# EAGLE design pitching_v2 (EAGLE 9.5.1)
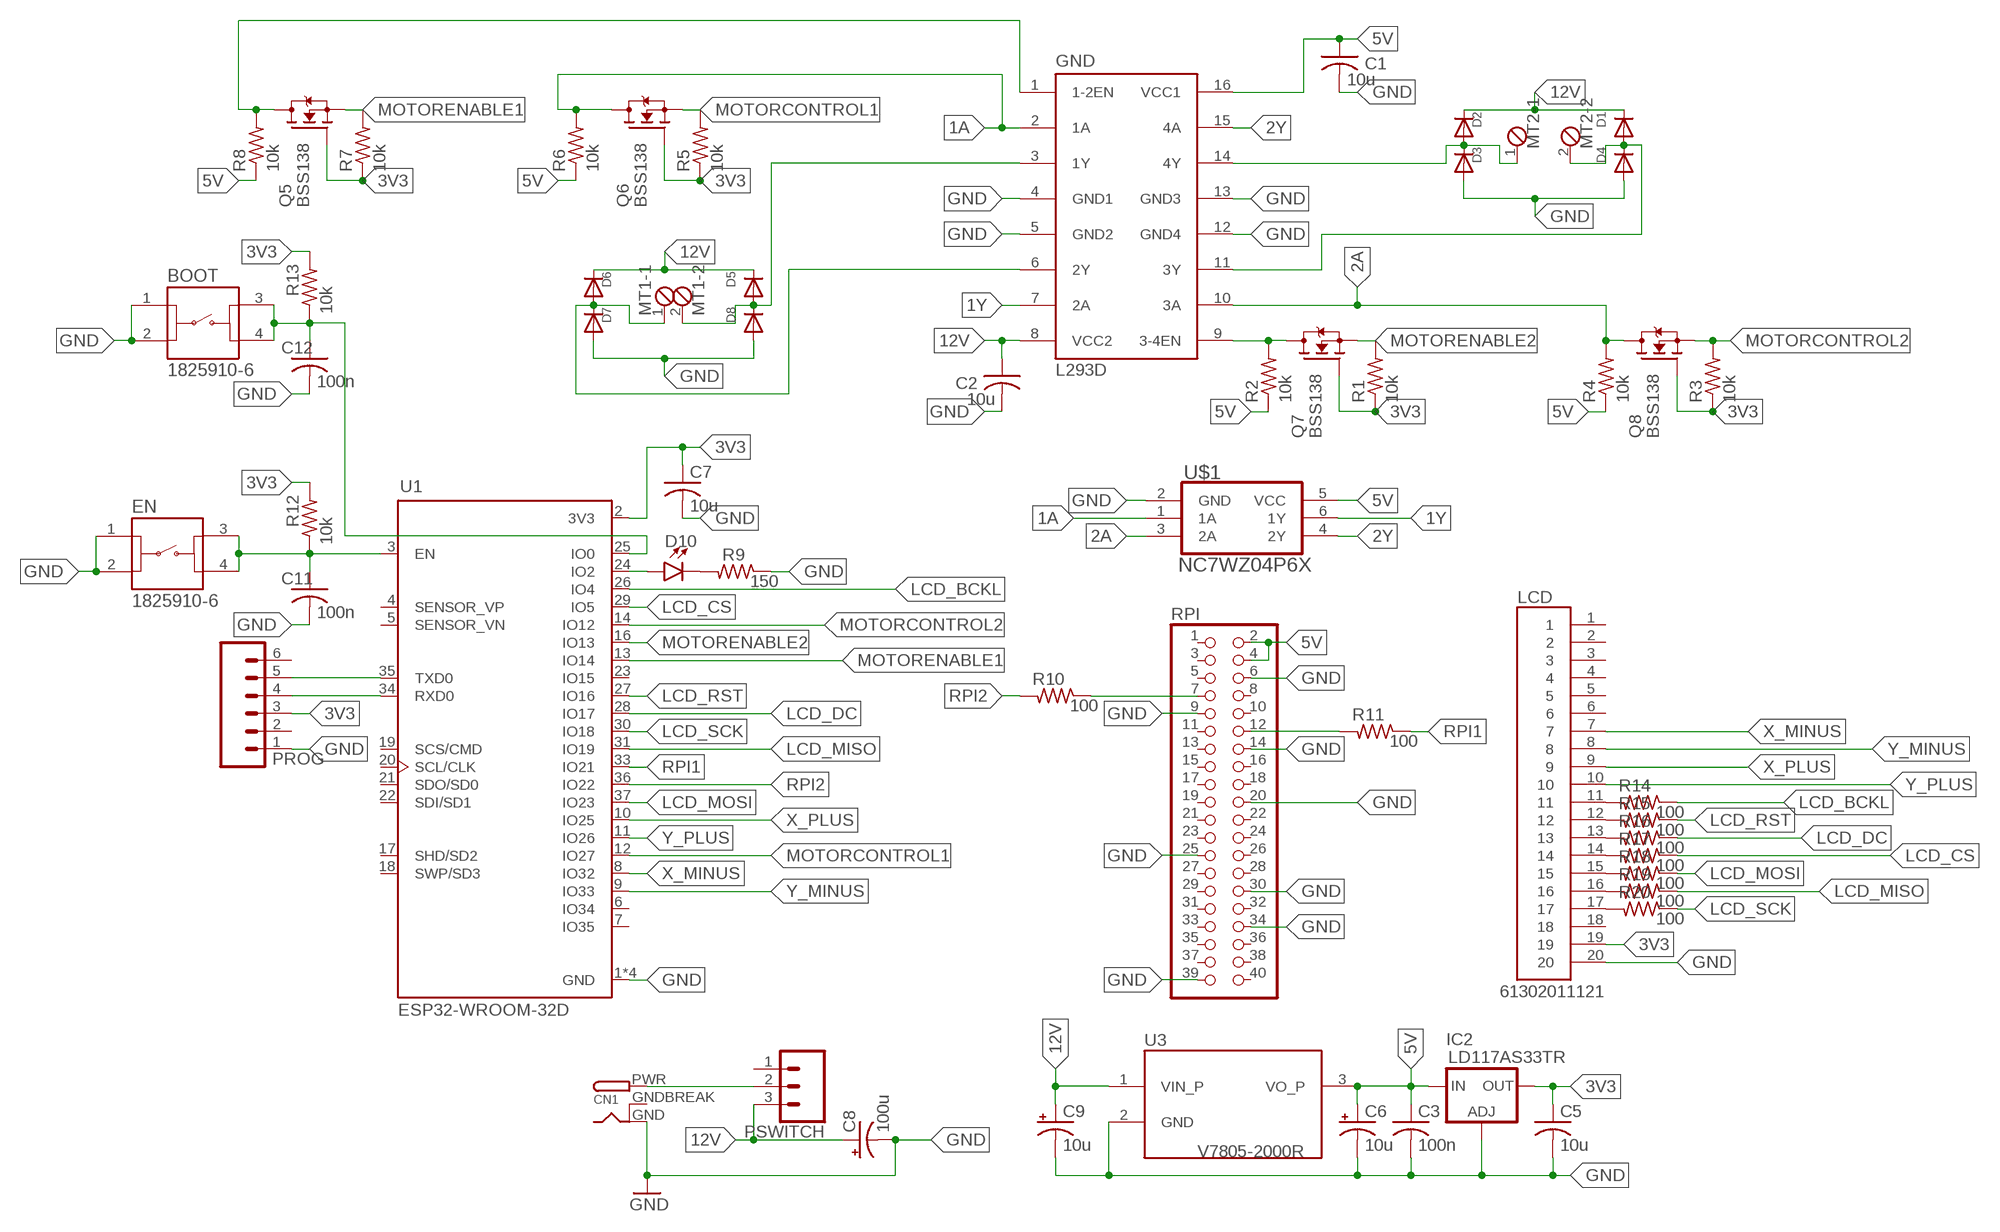
[diagram p0: schematic, sheet 1]

## Parts
BOOT  1825910-6  [1825910-6]
C1  10u  C-USC0805  [C0805]
C2  10u  C-USC0805  [C0805]
C3  100n  C-USC0805  [C0805]
C5  10u  C-USC0805  [C0805]
C6  10u  CPOL-US153CLV-0405  [153CLV-0405]
C7  10u  C-USC0805  [C0805]
C8  100u  CPOL-US153CLV-0810  [153CLV-0810]
C9  10u  CPOL-US153CLV-0405  [153CLV-0405]
C11  100n  C-USC0805  [C0805]
C12  100n  C-USC0805  [C0805]
CN1  DCBARRELPTH  [DCJACK_2MM_PTH]
D1  DIODESMA  [SMADIODE]
D2  DIODESMA  [SMADIODE]
D3  DIODESMA  [SMADIODE]
D4  DIODESMA  [SMADIODE]
D5  DIODESMA  [SMADIODE]
D6  DIODESMA  [SMADIODE]
D7  DIODESMA  [SMADIODE]
D8  DIODESMA  [SMADIODE]
D10  LED3MM  [LED_3MM]
EN  1825910-6  [1825910-6]
GND  L293D  [DIL16]
IC2  LD117AS33TR  [SOT223]
LCD  61302011121  [61302011121]
MT1  MPT2  [2POL254]
MT2  MPT2  [2POL254]
PROG  CONN_06SILK_FEMALE_PTH  [1X06]
PSWITCH  CONN_03  [1X03]
Q5  BSS138  [SOT23]
Q6  BSS138  [SOT23]
Q7  BSS138  [SOT23]
Q8  BSS138  [SOT23]
R1  10k  R-US_R0805  [R0805]
R2  10k  R-US_R0805  [R0805]
R3  10k  R-US_R0805  [R0805]
R4  10k  R-US_R0805  [R0805]
R5  10k  R-US_R0805  [R0805]
R6  10k  R-US_R0805  [R0805]
R7  10k  R-US_R0805  [R0805]
R8  10k  R-US_R0805  [R0805]
R9  150  R-US_R0805  [R0805]
R10  100  R-US_R0805  [R0805]
R11  100  R-US_R0805  [R0805]
R12  10k  R-US_R0805  [R0805]
R13  10k  R-US_R0805  [R0805]
R14  100  R-US_R0805  [R0805]
R15  100  R-US_R0805  [R0805]
R16  100  R-US_R0805  [R0805]
R17  100  R-US_R0805  [R0805]
R18  100  R-US_R0805  [R0805]
R19  100  R-US_R0805  [R0805]
R20  100  R-US_R0805  [R0805]
RPI  PINHD-2X20  [2X20]
U1  ESP32-WROOM-32D  [MODULE_ESP32-WROOM-32D]
U3  V7805-2000R  [CONV_V7805-2000R]
U$1  NC7WZ04P6X  [SOT65P210X110-6N]

## Nets
1A: GND.2(1A) Q6.3(D) R6.2 U$1.1(1A)
1Y: GND.7(2A) U$1.6(1Y)
2A: GND.10(3A) Q8.3(D) R4.2 U$1.3(2A)
2Y: GND.15(4A) U$1.4(2Y)
3V3: C5.1 C7.1 IC2.4(OUT) LCD.19 PROG.3 Q5.1(G) Q6.1(G) Q7.1(G) Q8.1(G) R1.1 R3.1 R5.1 R7.1 R12.2 R13.2 U1.2(3V3)
5V: C1.1 C3.1 C6.+ GND.16(VCC1) IC2.3(IN) R2.1 R4.1 R6.1 R8.1 RPI.2 RPI.4 U3.3(VO_P) U$1.5(VCC)
12V: C2.1 C8.+ C9.+ D1.C D2.C D5.C D6.C GND.8(VCC2) PSWITCH.3 U3.1(VIN_P)
BOOT: BOOT.3 BOOT.4 C12.1 R13.1 U1.25(IO0)
EN: C11.1 EN.3 EN.4 R12.1 U1.3(EN)
GND: BOOT.1 BOOT.2 C1.2 C2.2 C3.2 C5.2 C6.- C7.2 C8.- C9.- C11.2 C12.2 CN1.GND D3.A D4.A D7.A D8.A EN.1 EN.2 GND.4(GND1) GND.5(GND2) GND.12(GND4) GND.13(GND3) IC2.1(ADJ) LCD.20 PROG.1 R9.1 RPI.6 RPI.9 RPI.14 RPI.20 RPI.25 RPI.30 RPI.34 RPI.39 U1.1(GND) U1.15(GND) U1.38(GND) U1.39(GND) U3.2(GND) U$1.2(GND)
LCD_BCKL: R14.1 U1.26(IO4)
LCD_CS: R17.1 U1.29(IO5)
LCD_DC: R16.1 U1.28(IO17)
LCD_MISO: R19.1 U1.31(IO19)
LCD_MOSI: R18.1 U1.37(IO23)
LCD_RST: R15.1 U1.27(IO16)
LCD_SCK: R20.1 U1.30(IO18)
M1+: D5.A D8.C GND.3(1Y) MT1.2
M1-: D6.A D7.C GND.6(2Y) MT1.1
M2+: D1.A D4.C GND.11(3Y) MT2.2
M2-: D2.A D3.C GND.14(4Y) MT2.1
MOTORCONTROL1: Q6.2(S) R5.2 U1.12(IO27)
MOTORCONTROL2: Q8.2(S) R3.2 U1.14(IO12)
MOTORENABLE1: Q5.2(S) R7.2 U1.13(IO14)
MOTORENABLE2: Q7.2(S) R1.2 U1.16(IO13)
N$1: CN1.PWR PSWITCH.2
N$2: R11.2 RPI.12
N$3: LCD.11 R14.2
N$4: R10.1 RPI.7
N$7: LCD.12 R15.2
N$9: LCD.13 R16.2
N$10: GND.1(1-2EN) Q5.3(D) R8.2
N$11: GND.9(3-4EN) Q7.3(D) R2.2
N$13: D10.K(C) R9.2
N$14: LCD.14 R17.2
N$15: LCD.15 R18.2
N$16: PROG.5 U1.35(TXD0)
N$17: LCD.16 R19.2
N$18: LCD.17 R20.2
N$21: PROG.4 U1.34(RXD0)
N$26: D10.A U1.24(IO2)
RPI1: R11.1 U1.33(IO21)
RPI2: R10.2 U1.36(IO22)
X_MINUS: LCD.7 U1.8(IO32)
X_PLUS: LCD.9 U1.10(IO25)
Y_MINUS: LCD.8 U1.9(IO33)
Y_PLUS: LCD.10 U1.11(IO26)
Unconnected: LCD.1 LCD.2 LCD.3 LCD.4 LCD.5 LCD.6 LCD.18 PROG.2 PROG.6 PSWITCH.1 RPI.1 RPI.3 RPI.5 RPI.8 RPI.10 RPI.11 RPI.13 RPI.15 RPI.16 RPI.17 RPI.18 RPI.19 RPI.21 RPI.22 RPI.23 RPI.24 RPI.26 RPI.27 RPI.28 RPI.29 RPI.31 RPI.32 RPI.33 RPI.35 RPI.36 RPI.37 RPI.38 RPI.40 U1.4(SENSOR_VP) U1.5(SENSOR_VN) U1.6(IO34) U1.7(IO35) U1.17(SHD/SD2) U1.18(SWP/SD3) U1.19(SCS/CMD) U1.20(SCL/CLK) U1.21(SDO/SD0) U1.22(SDI/SD1) U1.23(IO15)

## Power pins joined to a net without a drawn wire
GNDBREAK: CN1.GNDBREAK

## Library data of the parts
BOOT EN = Switch:1825910-6: SWITCH TACTILE SPST-NO 0.05A 24V Manufacturer's datasheet <https://www.te.com/commerce/DocumentDelivery/DDEController?Action=srchrtrv&DocNm=1825910&DocType=Customer+Drawing&DocLang=English>; CREATED_BY: PCBLayout.com; DIGIKEY_PART_NUMBER: 450-1650-ND; MANUFACTURER: TE Connectivity ALCOSWITCH Switches; MPN: 1825910-6
C1-C3 C5 C7 C11 C12 = resistor:C-US: CAPACITOR, American symbol
C6 C8 C9 = rcl:CPOL-US: POLARIZED CAPACITOR, American symbol; SPICEPREFIX: C
CN1 = adafruit:DCBARREL: 2.0mm DC Barrel Jack DCJACK_2MM_PTH - Through Hole Jack (4UConnector: 05537)
D1-D8 = adafruit:DIODE: Diode SMADIODE - SMA Surface Mount Package 20V 1A Schottky Diode Digikey: 641-1014-6-ND DO-1N4148 - Through Hole Small Current Diode SOD-123 20V 1 A (.5mV Vf) Schottky Diode - Digikey: MBRX120TPMSCT-ND SOD-323 10V 570mA (.38mV Vf, 3ns) Schottky Diode - Digikey: ZLLS410CT-ND SOD-523 30V 30mA Schottky Diode (RB751S-40TE61) - Digikey: RB751S-40TE61CT-ND SOT23-R/W - SOT23 Package (R = Solder Paste/Reflow Ovens, W = Hand-Soldering) BAT54Film 40V 300mA - Digikey: 497-7162-1-ND
D10 = SparkFun-LED:LED: LED (Generic) Standard schematic elements and footprints for 5mm, 3mm, 1206, and 0603 sized LEDs. Generic LEDs with no color specified.; PROD_ID: DIO-08794
GND = st-microelectronics:L293D: PUSH-PULL 4 CHANNEL DRIVER; MPN: L293D; OC_FARNELL: 9589619; OC_NEWARK: 56P8249
IC2 = v-reg:LD117A?*: Low drop fixed and adjustable positive voltage regulators 1 A Source: http://www.st.com/stonline/products/literature/ds/7194/ld1117axx.pdf
LCD = Headers:61302011121: CONN HEADER VERT 20POS 2.54MM Manufacturer's datasheet <https://katalog.we-online.de/em/datasheet/6130xx11121.pdf>; CREATED_BY: PCBLayout.com; DIGIKEY_PART_NUMBER: 732-5329-ND; MANUFACTURER: Wurth Electronics Inc.; MPN: 61302011121
MT1 MT2 = con-phoenix-254:MPT2: PHOENIX CONNECTOR; OC_FARNELL: unknown; OC_NEWARK: unknown
PROG = SparkFun-Connectors:CONN_06: Multi connection point. Often used as Generic Header-pin footprint for 0.1 inch spaced/style header connections On any of the 0.1 inch spaced packages, you can populate with these: Break Away Headers - Straight <https://www.sparkfun.com/products/116> (PRT-00116) Break Away Male Headers - Right Angle <https://www.sparkfun.com/products/553> (PRT-00553) Female Headers <https://www.sparkfun.com/products/115> (PRT-00115) Break Away Headers - Machine Pin <https://www.sparkfun.com/products/117> (PRT-00117) Break Away Female Headers - Swiss Machine Pin <https://www.sparkfun.com/products/743> (PRT-00743) Arduino Stackable Header - 6 Pin <https://www.sparkfun.com/products/9280> (PRT-09280) For SCREWTERMINALS and SPRING TERMINALS visit here: Screw Terimnals on SparkFun.com <https://www.sparkfun.com/search/results?term=Screw+Terminals> (5mm/3.5mm/2.54mm spacing) This device is also useful as a general connection point to wire up your design to another part of your project. Our various solder wires solder well into these plated through hole pads. Hook-Up Wire - Assortment (Stranded, 22 AWG) <https://www.sparkfun.com/products/11375> (PRT-11375) Hook-Up Wire - Assortment (Solid Core, 22 AWG) <https://www.sparkfun.com/products/11367> (PRT-11367) View the entire wire category on our website here <https://www.sparkfun.com/categories/141>; PROD_ID: CONN-08437
PSWITCH = SparkFun-Connectors:CONN_03: Multi connection point. Often used as Generic Header-pin footprint for 0.1 inch spaced/style header connections On any of the 0.1 inch spaced packages, you can populate with these: Break Away Headers - Straight <https://www.sparkfun.com/products/116> (PRT-00116) Break Away Male Headers - Right Angle <https://www.sparkfun.com/products/553> (PRT-00553) Female Headers <https://www.sparkfun.com/products/115> (PRT-00115) Break Away Headers - Machine Pin <https://www.sparkfun.com/products/117> (PRT-00117) Break Away Female Headers - Swiss Machine Pin <https://www.sparkfun.com/products/743> (PRT-00743) Stackable Header - 3 Pin (Female, 0.1") <https://www.sparkfun.com/products/13875> (PRT-13875) For SCREWTERMINALS and SPRING TERMINALS visit here: Screw Terimnals on SparkFun.com <https://www.sparkfun.com/search/results?term=Screw+Terminals> (5mm/3.5mm/2.54mm spacing) This device is also useful as a general connection point to wire up your design to another part of your project. Our various solder wires solder well into these plated through hole pads. Hook-Up Wire - Assortment (Stranded, 22 AWG) <https://www.sparkfun.com/products/11375> (PRT-11375) Hook-Up Wire - Assortment (Solid Core, 22 AWG) <https://www.sparkfun.com/products/11367> (PRT-11367) View the entire wire category on our website here <https://www.sparkfun.com/categories/141> Special notes: Molex polarized connector foot print use with SKU : PRT-08232 with associated crimp pins and housings.
Q5-Q8 = bss138_10:BSS138: BSS138 N-Channel Logic Level Enhancement Mode Field Effect Transistor Source: http://www.fairchildsemi.com/datasheets/BS/BSS138.pdf; MF: Fairchild; MPN: BSS138; OC_FARNELL: 9845330; OC_NEWARK: 67R2009
R1-R20 = rcl:R-US_: RESISTOR, American symbol; SPICEPREFIX: R
RPI = adafruit:PINHD-2X20: PIN HEADER
U1 = ESP32-WROOM-32D:ESP32-WROOM-32D: IC: SoC; GPIO, I2C, I2S, IR, SD, SDIO, SPI, UART; 2.7÷3.6VDC; 20dBm; AVAILABILITY: Unavailable; DESCRIPTION: IC: SoC; GPIO, I2C, I2S, IR, SD, SDIO, SPI, UART; 2.7÷3.6VDC; 20dBm; MF: Espressif Systems; MP: ESP32-WROOM-32D; PACKAGE: Module Espressif Systems; PRICE: None
U3 = V7805-2000R:V7805-2000R; MANUFACTURER: CUI INC; PARTREV: 1.03; STANDARD: MANUFACTURER RECOMMENDATIONS
U$1 = NC7WZ04P6X:NC7WZ04P6X

## Board
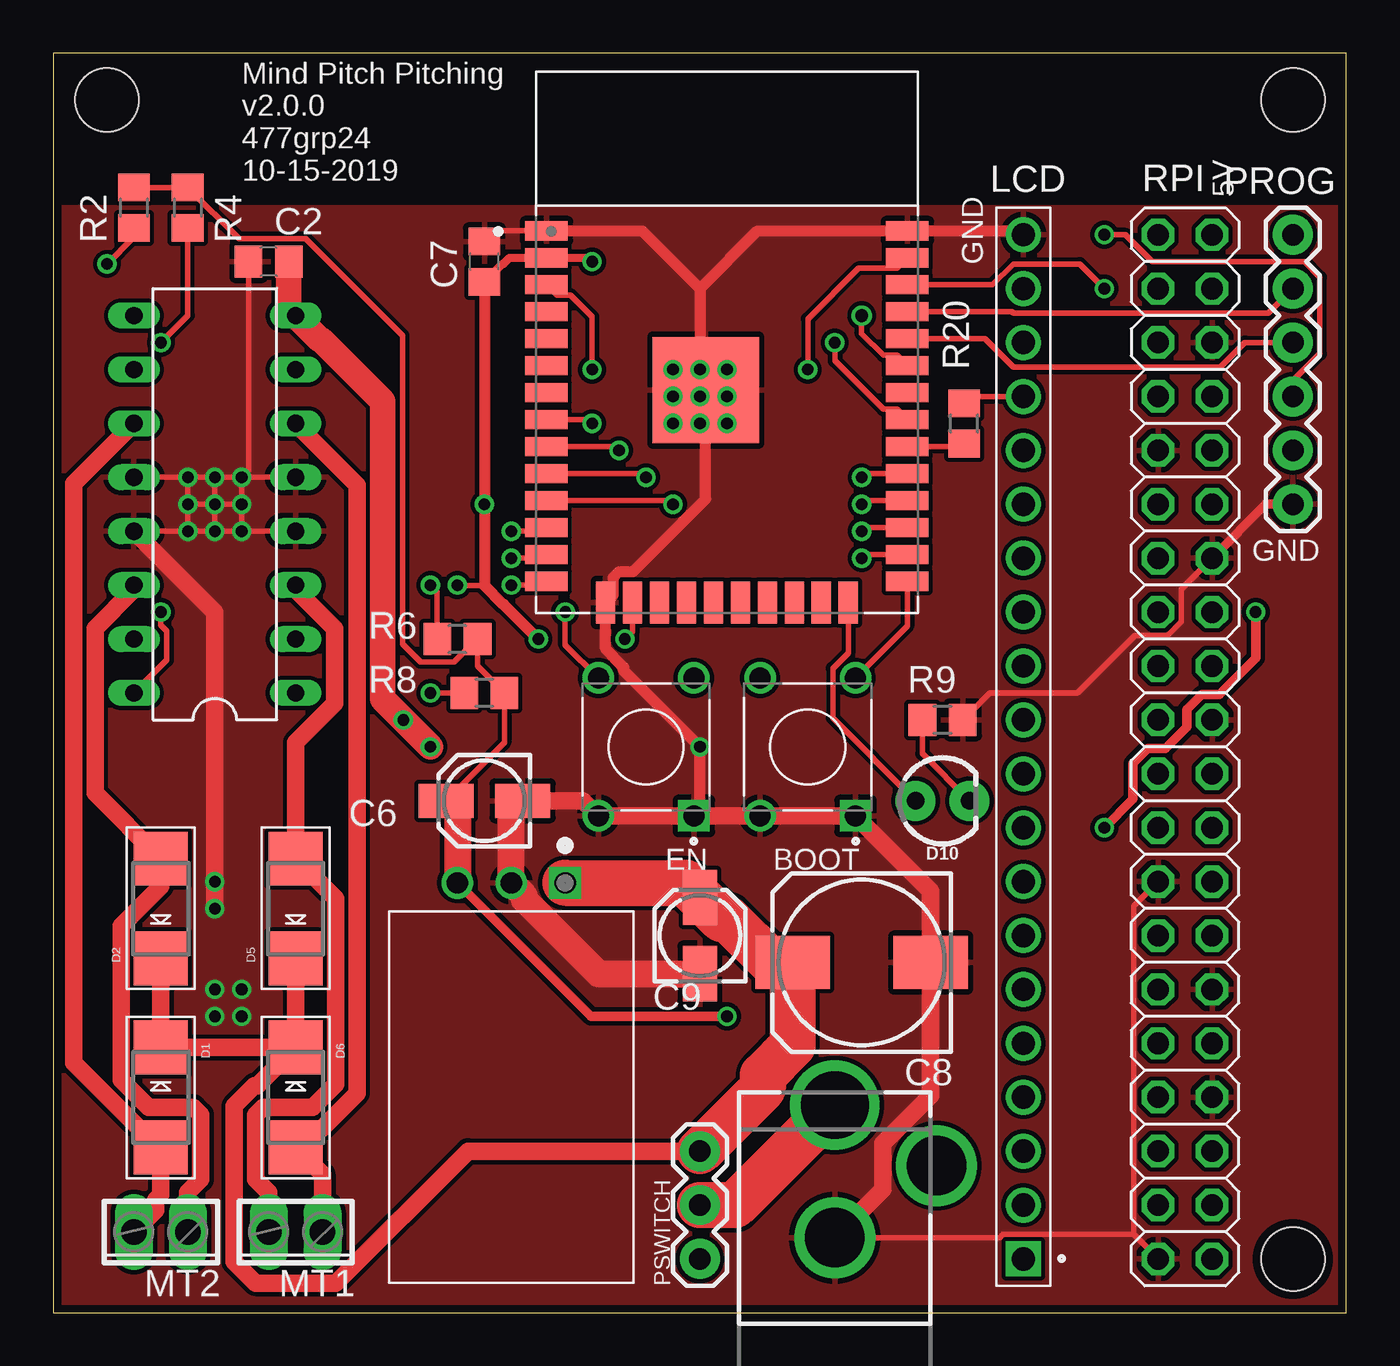
[diagram p1: board, top side]
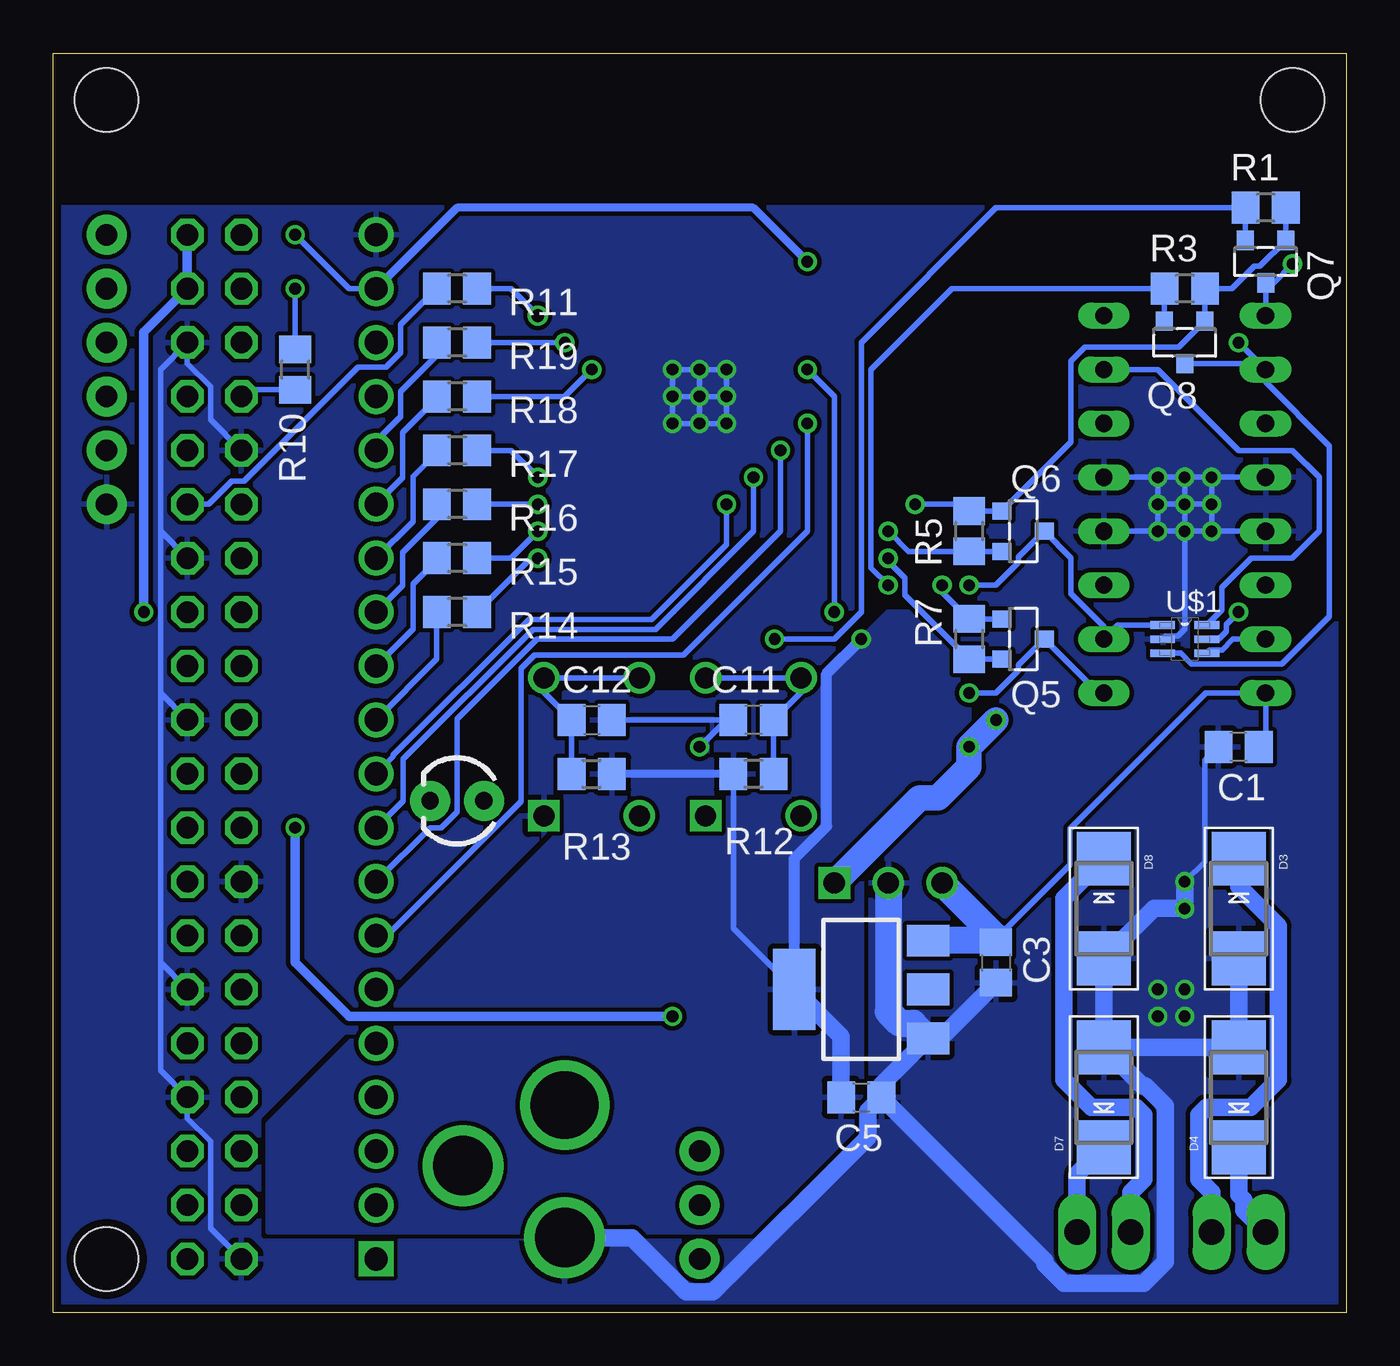
[diagram p2: board, bottom side, seen from below]

Size 60.94 x 59.36 mm. Coordinates in mm from the lower left corner, seen from the top.
Outline: 0,0 60.94,0 60.94,59.36 0,59.36 0,0
Copper layers (1*16): Top 0.0356mm / dielectric 1.5011mm / Bottom 0.0356mm
Design rules "ECE_Senior_Design *": minimum track width 8mil, minimum drill 13mil, track to track 8mil, track to pad 8mil, pad to pad 6mil, via to via 8mil, smd to smd 6mil, copper to edge 15mil, drill to drill 8mil, minimum pad ring 7mil, minimum via ring 7mil, stop-mask expansion 3mil, vias tented up to drill 0mil, thermal gap 10mil
Holes 3 mm at 2.54,57.15 58.42,57.15 58.42,2.54

### Footprints (pad centres in the part's own frame; a part is rotated, then mirrored left to right if it is on the bottom)
1825910-6 = drill 0.99 square: 1 3.25,2.25 | drill 0.99: 2 3.25,-2.25; 3 -3.25,2.25; 4 -3.25,-2.25
C0805 = smd 1.3 x 1.5: 1 -0.95,0; 2 0.95,0
153CLV-0405 = smd 2.6 x 1.6: + 1.8,0; - -1.8,0
153CLV-0810 = smd 3.5 x 2.5: + 3.25,0; - -3.25,0
DCJACK_2MM_PTH = drill 2.8: GND 0,7.35; GNDBREAK 4.8,10.75 | drill 3.2: PWR 0,13.6
SMADIODE = smd 2.54 x 2.54: A 2.349,0; C -2.349,0
LED_3MM = drill 0.813 pad 1.88: A -1.27,0; K 1.27,0
DIL16 = drill 0.813 long: 1 -8.89,-3.81; 2 -6.35,-3.81; 3 -3.81,-3.81; 4 -1.27,-3.81; 5 1.27,-3.81; 6 3.81,-3.81; 7 6.35,-3.81; 8 8.89,-3.81; 9 8.89,3.81; 10 6.35,3.81; 11 3.81,3.81; 12 1.27,3.81; 13 -1.27,3.81; 14 -3.81,3.81; 15 -6.35,3.81; 16 -8.89,3.81
SOT223 = smd 1.5 x 2: 1 -2.3,-3.15; 2 0,-3.15; 3 2.3,-3.15 | smd 3.8 x 2: 4 0,3.15
61302011121 = drill 1.1 square: 1 -24.13,0 | drill 1.1: 2 -21.59,0; 3 -19.05,0; 4 -16.51,0; 5 -13.97,0; 6 -11.43,0; 7 -8.89,0; 8 -6.35,0; 9 -3.81,0; 10 -1.27,0; 11 1.27,0; 12 3.81,0; 13 6.35,0; 14 8.89,0; 15 11.43,0; 16 13.97,0; 17 16.51,0; 18 19.05,0; 19 21.59,0; 20 24.13,0
2POL254 = drill 1.2 long: 1 -1.27,0; 2 1.27,0
1X06 = drill 1.016 pad 1.88: 1 0,0; 2 2.54,0; 3 5.08,0; 4 7.62,0; 5 10.16,0; 6 12.7,0
1X03 = drill 1.016 pad 1.88: 1 0,0; 2 2.54,0; 3 5.08,0
SOT23 = smd 0.8 x 0.9: 1 -0.95,-1; 2 0.95,-1; 3 0,1
R0805 = smd 1.3 x 1.5: 1 -0.95,0; 2 0.95,0
2X20 = drill 1.016 octagon: 1 -24.13,-1.27; 2 -24.13,1.27; 3 -21.59,-1.27; 4 -21.59,1.27; 5 -19.05,-1.27; 6 -19.05,1.27; 7 -16.51,-1.27; 8 -16.51,1.27; 9 -13.97,-1.27; 10 -13.97,1.27; 11 -11.43,-1.27; 12 -11.43,1.27; 13 -8.89,-1.27; 14 -8.89,1.27; 15 -6.35,-1.27; 16 -6.35,1.27; 17 -3.81,-1.27; 18 -3.81,1.27; 19 -1.27,-1.27; 20 -1.27,1.27; 21 1.27,-1.27; 22 1.27,1.27; 23 3.81,-1.27; 24 3.81,1.27; 25 6.35,-1.27; 26 6.35,1.27; 27 8.89,-1.27; 28 8.89,1.27; 29 11.43,-1.27; 30 11.43,1.27; 31 13.97,-1.27; 32 13.97,1.27; 33 16.51,-1.27; 34 16.51,1.27; 35 19.05,-1.27; 36 19.05,1.27; 37 21.59,-1.27; 38 21.59,1.27; 39 24.13,-1.27; 40 24.13,1.27
MODULE_ESP32-WROOM-32D = smd 2 x 0.9: 1 -8.5,5.26; 2 -8.5,3.99; 3 -8.5,2.72; 4 -8.5,1.45; 5 -8.5,0.18; 6 -8.5,-1.09; 7 -8.5,-2.36; 8 -8.5,-3.63; 9 -8.5,-4.9; 10 -8.5,-6.17; 11 -8.5,-7.44; 12 -8.5,-8.71; 13 -8.5,-9.98; 14 -8.5,-11.25; 25 8.5,-11.25; 26 8.5,-9.98; 27 8.5,-8.71; 28 8.5,-7.44; 29 8.5,-6.17; 30 8.5,-4.9; 31 8.5,-3.63; 32 8.5,-2.36; 33 8.5,-1.09; 34 8.5,0.18; 35 8.5,1.45; 36 8.5,2.72; 37 8.5,3.99; 38 8.5,5.26 | smd 0.9 x 2: 15 -5.715,-12.25; 16 -4.445,-12.25; 17 -3.175,-12.25; 18 -1.905,-12.25; 19 -0.635,-12.25; 20 0.635,-12.25; 21 1.905,-12.25; 22 3.175,-12.25; 23 4.445,-12.25; 24 5.715,-12.25 | smd 5 x 5: 39 -1,-2.24
CONV_V7805-2000R = drill 1 square: 1 -10.1,2.54 | drill 1: 2 -10.1,0; 3 -10.1,-2.54
SOT65P210X110-6N = smd 1.168 x 0.356: 1 -1.041,0.66; 2 -1.041,0; 3 -1.041,-0.66; 4 1.041,-0.66; 5 1.041,0; 6 1.041,0.66

### Placement (x,y rotation side)
BOOT  35.56,26.67 270 top
C1  5.08,26.67 180 bottom
C2  10.16,49.53 180 top
C3  16.51,16.51 270 bottom
C5  22.86,10.16 0 bottom
C6  20.32,24.13 180 top
C7  20.32,49.53 90 top
C8  38.1,16.51 180 top
C9  30.48,17.78 90 top
C11  27.94,27.94 180 bottom
C12  35.56,27.94 0 bottom
CN1  36.83,-3.81 0 top
D1  5.08,10.16 270 top
D2  5.08,19.05 90 top
D3  5.08,19.05 270 bottom
D4  5.08,10.16 90 bottom
D5  11.43,19.05 90 top
D6  11.43,10.16 270 top
D7  11.43,10.16 90 bottom
D8  11.43,19.05 270 bottom
D10  41.91,24.13 0 top
EN  27.94,26.67 270 top
GND  7.62,38.1 90 top
IC2  22.86,15.24 90 bottom
LCD  45.72,26.67 90 top
MT1  11.43,3.81 180 top
MT2  5.08,3.81 180 top
PROG  58.42,38.1 90 top
PSWITCH  30.48,2.54 90 top
Q5  15.24,31.75 270 bottom
Q6  15.24,36.83 270 bottom
Q7  3.81,49.53 180 bottom
Q8  7.62,45.72 180 bottom
R1  3.81,52.07 180 bottom
R2  3.81,52.07 270 top
R3  7.62,48.26 180 bottom
R4  6.35,52.07 270 top
R5  17.78,36.83 270 bottom
R6  19.05,31.75 180 top
R7  17.78,31.75 270 bottom
R8  20.32,29.21 180 top
R9  41.91,27.94 180 top
R10  49.53,44.45 90 bottom
R11  41.91,48.26 180 bottom
R12  27.94,25.4 180 bottom
R13  35.56,25.4 0 bottom
R14  41.91,33.02 180 bottom
R15  41.91,35.56 180 bottom
R16  41.91,38.1 180 bottom
R17  41.91,40.64 180 bottom
R18  41.91,43.18 180 bottom
R19  41.91,45.72 180 bottom
R20  42.93,41.91 90 top
RPI  53.34,26.67 270 top
U1  31.75,45.72 0 top
U3  21.59,10.16 270 top
U$1  7.62,31.75 0 bottom

### Tracks (layer width: path | path; a pad name or v marks a point on that pad's centre or on a via)
1A  (via drill 0.55 pad 0.6)
  Top 0.254: v17.78,34.29 18.1,33.97 R6.2
  Bottom 0.254: U$1.1 10.77,32.41 GND.2 11.43,32.35 12.98,33.9 12.98,35.57 Q6.3 15.46,35.61 15.46,35.34 16.51,34.29 v17.78,34.29
1Y
  Bottom 0.254: U$1.6 5.86,33.13 5.86,34.18 4.48,35.56 2.54,35.56 1.27,36.83 1.27,39.37 2.54,40.64 5.08,40.64 8.89,44.45 GND.7
2A  (via drill 0.55 pad 0.6)
  Top 0.254: v5.08,45.72 6.35,46.99 R4.2
  Bottom 0.254: GND.10 3.81,43.85 0.81,40.85 0.81,32.81 3.04,30.58 7.3,30.58 7.81,31.09 U$1.3 | GND.10 4.08,44.72 Q8.3 | GND.10 v5.08,45.72
2Y
  Bottom 0.254: U$1.4 6.43,31.24 5.86,31.24 5.35,31.75 GND.15
3V3  (via drill 0.55 pad 0.6)
  Top 0.254: v49.53,50.8 50.52,50.8 51.8,49.53 58.95,49.53 59.69,48.79 59.69,45.19 58.42,43.92 PROG.3 | 20.32,34.27 19.07,34.27 v19.05,34.29
  Top 0.381: v25.4,49.53 25.22,49.71 U1.2 21.51,49.71 21.23,49.44 21.18,49.44 C7.1
  Top 0.508: v22.86,31.75 21.23,33.38 21.21,33.38 20.32,34.27 v20.32,38.1 C7.1
  Bottom 0.254: v49.53,50.8 46.99,48.26 LCD.19 | Q5.1 R7.1 19.05,33.97 v19.05,34.29 | R1.1 Q7.1 4.08,49.31 4.35,49.31 5.4,48.26 R3.1 Q8.1 7.89,45.5 12.32,45.5 12.98,44.84 12.98,41.04 Q6.1 R5.1 18.1,38.1 v20.32,38.1 | R12.2 28.89,18.12 IC2.4
  Bottom 0.381: v25.4,49.53 27.94,52.07 41.91,52.07 LCD.19 | R12.2 R13.2
  Bottom 0.508: v22.86,31.75 24.49,30.12 24.49,22.92 26.01,21.4 IC2.4
  Bottom 0.813: C5.1 23.81,13.04 IC2.4
  pour Bottom: 27.94,3.81 22.86,8.89 22.86,21.59 17.78,26.67 17.78,30.48 20.32,33.02 21.59,33.02 25.4,29.21 36.83,29.21 36.83,22.86 50.8,8.89 50.8,3.81
5V  (via drill 0.55 pad 0.6)
  Top 0.254: v5.08,33.02 5.08,32.42 5.36,32.14 5.36,30.76 GND.16 | R2.1 R4.1 8.76,50.61 11.9,50.61 16.46,46.05 16.46,31.52 17.31,30.67 18.89,30.67 19.97,31.75 R6.1 20,30.48 R8.1 21.27,26.88 C6.+
  Top 0.457: U3.3 25.34,13.97 v31.75,13.97 | v49.53,22.86 50.88,24.21 50.88,25.89 51.58,26.59 52.41,26.59 53.42,27.6 53.42,28.43 54.12,29.13 54.95,29.13 56.66,30.84 v56.66,33.02
  Top 1.27: C6.+ 19.05,23.6 U3.3
  Bottom 0.254: C1.1 3.81,26.99 GND.16 6.63,29.21 13.03,22.81 13.03,21.1 16.59,17.54 | v5.08,33.02 5.66,32.44 5.66,32.1 6.01,31.75 U$1.5
  Bottom 0.457: v31.75,13.97 46.99,13.97 49.53,16.51 v49.53,22.86 | RPI.2 RPI.4 56.66,46.21 v56.66,33.02
  Bottom 1.27: U3.3 16.51,17.72 C3.1 16.59,17.54 IC2.3
12V  (via drill 0.55 pad 0.6)
  Top 0.813: D2.C D1.C D6.C | D6.C 9.63,10.71 9.49,10.71 8.53,9.75 8.53,2.4 9.54,1.4 13.32,1.4 19.55,7.62 PSWITCH.3 | D5.C D6.C
  Top 1.194: v17.78,26.67 v16.51,27.94 15.53,28.92 15.53,42.95 12.62,45.86 12.56,45.86 GND.8 11.11,47.31 C2.1
  Top 2.159: PSWITCH.3 33.44,10.58 33.44,11.19 34.85,12.61 C8.+ 33.86,16.51 31.81,18.56 31.5,18.56 C9.+ 29.8,20.26 U3.1
  Bottom 1.194: v16.51,27.94 v17.78,26.67 17.78,25.73 19.24,24.27 20.12,24.27 U3.1
BOOT
  Top 0.254: U1.25 40.25,32.36 BOOT.3
  Bottom 0.254: BOOT.4 BOOT.3 37.81,29.24 C12.1 R13.1
EN  (via drill 0.55 pad 0.6)
  Top 0.254: EN.4 24.13,31.48 v24.13,33.02 | U1.3 23.74,47.95 24.39,47.95 25.4,46.94 v25.4,44.45
  Bottom 0.254: EN.3 EN.4 25.69,29.24 C11.1 R12.1 | v24.13,33.02 24.13,43.18 v25.4,44.45
GND  (via drill 0.55, 0.55 pad 0.6)
  Top 0.203: v30.48,43.18 30.48,43.21 U1.39 | U1.39 30.48,43.75 v30.48,44.45 | U1.39 31.75,42.48 v31.75,41.91 | U1.39 30.75,43.18 30.75,42.18 v30.48,41.91 | U1.39 30.75,43.45 v29.21,41.91 | U1.39 30.45,43.18 v29.21,43.18 | U1.39 29.78,44.45 v29.21,44.45
  Top 0.254: C7.2 20.82,50.98 U1.1 | CN1.GND 44.6,3.54 44.76,3.69 50.91,3.69 | RPI.39 50.91,3.69 | 50.91,3.69 50.91,19.16 RPI.25 | GND.12 v6.35,39.37 | v6.35,39.37 v7.62,39.37 | v7.62,39.37 v8.89,39.37 | v8.89,39.37 GND.5 | v8.89,39.37 v8.89,38.1 | v8.89,38.1 v8.89,36.83 | v8.89,36.83 GND.4 | v8.89,36.83 v7.62,36.83 | v7.62,36.83 v7.62,38.1 | v7.62,38.1 v7.62,39.37 | v8.89,38.1 v7.62,38.1 | v7.62,38.1 v6.35,38.1 | v6.35,38.1 v6.35,39.37 | v6.35,38.1 v6.35,36.83 | v6.35,36.83 v7.62,36.83 | v6.35,36.83 GND.13 | RPI.14 53.16,34.11 53.16,32.57 52.52,31.93 50.98,31.93 48.26,29.21 44.13,29.21 R9.1 | C2.2 9.21,39.69 v8.89,39.37
  Top 0.457: RPI.14 57.15,38.1 PROG.1
  Top 0.508: 30.75,43.18 30.75,38.35 27.32,34.93 26.67,34.93 26.4,34.66 26.4,33.83 U1.15 26.04,31.27 26.89,30.42 26.89,30.26 v30.48,26.67 30.48,23.71 EN.1 | U1.1 27.76,50.98 30.48,48.26 | 30.48,48.26 v30.48,44.45 | 30.48,48.26 33.2,50.98 U1.38 45.54,50.98 LCD.20
  Top 0.813: C6.- 24.98,24.13 EN.2 EN.1 BOOT.2 BOOT.1 41.35,19.88 C8.- 41.35,10.22 39.11,7.98 39.11,5.82 CN1.GND | GND.13 7.62,33.02 v7.62,20.32 v7.62,19.05
  Top 1.27: C6.- 21.59,23.6 U3.2 22.21,19.64 22.21,19.47 25.7,15.98 C9.-
  Bottom 0.254: 55.88,36.83 55.88,44.45 RPI.6 54.61,44.73 53.52,43.63 53.52,42.09 RPI.9 | 55.88,36.83 RPI.14 | RPI.20 55.88,29.21 | 55.88,29.21 55.88,36.83 | 55.88,29.21 55.88,16.51 | 55.88,16.51 RPI.30 | 55.88,16.51 55.88,11.43 RPI.34 54.61,9.16 53.52,8.07 53.52,3.99 RPI.39 | C12.2 C11.2 29.21,27.94 v30.48,26.67 | GND.12 v6.35,39.37 | v6.35,39.37 v7.62,39.37 | v7.62,39.37 v8.89,39.37 | v8.89,39.37 GND.5 | v8.89,39.37 v8.89,38.1 | v8.89,38.1 v8.89,36.83 | v8.89,36.83 GND.4 | v8.89,36.83 v7.62,36.83 | v7.62,36.83 v7.62,38.1 | v7.62,38.1 v8.89,38.1 | v7.62,38.1 v7.62,39.37 | v6.35,39.37 v6.35,38.1 | v6.35,38.1 v7.62,38.1 | v6.35,38.1 v6.35,36.83 | v6.35,36.83 v7.62,36.83 | v6.35,36.83 GND.13 | v30.48,44.45 v29.21,44.45 v29.21,43.18 | v31.75,43.18 v31.75,44.45 v30.48,44.45 | v31.75,43.18 v31.75,41.91 v30.48,41.91 | v30.48,41.91 v30.48,43.18 | v30.48,43.18 v29.21,43.18 | v29.21,43.18 v29.21,41.91 v30.48,41.91 | v30.48,44.45 v30.48,43.18 | v30.48,43.18 v31.75,43.18 | U$1.2 8.51,31.9 7.94,31.9 7.62,32.22 v7.62,36.83 | C1.2 6.68,26.02 6.68,21.26 v7.62,20.32
  Bottom 0.813: D7.A D4.A D3.A | D7.A 9.63,10.71 9.49,10.71 8.53,9.75 8.53,2.4 9.54,1.4 13.32,1.4 14.21,2.29 14.21,2.46 C5.2 | C3.2 19.13,12.94 IC2.1 21.91,10.74 C5.2 | v7.62,20.32 v7.62,19.05 9.08,19.05 D8.A D7.A | C5.2 22.55,9.52 22.55,8.28 29.84,0.99 31.12,0.99 33.67,3.54 CN1.GND
  Bottom 1.27: IC2.1 20.42,13.65 21.06,13.65 21.59,14.19 U3.2
  other vias: 7.62,15.24 8.89,15.24 8.89,13.97 7.62,13.97
  pour Top: 2.54,40.64 2.54,35.56 12.7,35.56 12.7,40.64
  pour Bottom: 2.54,35.56 12.7,35.56 12.7,40.64 2.54,40.64
  pour Bottom (rank 2): 0,0 60.96,0 60.96,52.07 0,52.07
  pour Top: 0,0 0,52.07 60.96,52.07 60.96,0
LCD_BCKL  (via drill 0.55 pad 0.6)
  Top 0.254: U1.26 38.28,35.74 v38.1,35.56
  Bottom 0.254: v38.1,35.56 38.42,35.56 R14.1
LCD_CS  (via drill 0.55 pad 0.6)
  Top 0.254: U1.29 38.28,39.55 v38.1,39.37
  Bottom 0.254: R17.1 39.37,40.64 v38.1,39.37
LCD_DC  (via drill 0.55 pad 0.6)
  Top 0.254: U1.28 38.28,38.28 v38.1,38.1
  Bottom 0.254: v38.1,38.1 R16.1
LCD_MISO  (via drill 0.55 pad 0.6)
  Top 0.254: U1.31 39.76,42.58 39.11,42.58 36.83,44.86 v36.83,45.72
  Bottom 0.254: R19.1 v36.83,45.72
LCD_MOSI  (via drill 0.55 pad 0.6)
  Top 0.254: U1.37 39.76,49.22 37.95,49.22 35.56,46.83 v35.56,44.45
  Bottom 0.254: R18.1 36.83,43.18 v35.56,44.45
LCD_RST  (via drill 0.55 pad 0.6)
  Top 0.254: U1.27 38.28,37.01 v38.1,36.83
  Bottom 0.254: R15.1 39.37,35.56 v38.1,36.83
LCD_SCK
  Top 0.254: R20.1 42.79,40.82 U1.30
M1+
  Top 0.813: MT1.2 10.16,5.68 9.55,6.29 9.55,9.33 9.91,9.69 12.23,9.69 13.31,10.77 13.31,19.52 D8.C 11.43,26.88 13.26,28.7 13.26,32.26 11.43,34.08 GND.3
  Bottom 0.813: D8.C 13.31,19.52 13.31,10.99 12.01,9.69 9.91,9.69 9.55,9.33 9.55,6.29 10.16,5.68 MT1.2
M1-
  Top 0.813: MT1.1 12.7,6.54 D7.C 12.29,8.67 12.65,8.67 14.33,10.35 14.33,39.01 GND.6
  Bottom 0.813: MT1.1 12.7,6.54 D7.C
M2+
  Top 0.813: MT2.2 4.84,4.84 4.84,5.33 5.08,5.58 D4.C 4.22,8.67 4.08,8.67 0.96,11.79 0.96,39.06 GND.11
  Bottom 0.813: D4.C 5.08,5.58 4.84,5.33 4.84,4.84 MT2.2
M2-
  Top 0.813: GND.14 3.81,34.08 1.98,32.26 1.98,24.5 D3.C 5.08,20.1 3.2,18.22 3.2,10.99 4.5,9.69 6.6,9.69 6.96,9.33 6.96,6.29 6.35,5.68 MT2.1
  Bottom 0.813: MT2.1 6.35,5.68 6.96,6.29 6.96,9.33 6.6,9.69 4.5,9.69 3.2,10.99 3.2,18.22 5.08,20.1 D3.C
MOTORCONTROL1  (via drill 0.55 pad 0.6)
  Top 0.254: U1.12 23.07,36.83 v21.59,36.83
  Bottom 0.254: Q6.2 R5.2 20.64,35.88 v21.59,36.83
MOTORCONTROL2  (via drill 0.55 pad 0.6)
  Top 0.254: U1.14 23.07,34.29 v21.59,34.29
  Bottom 0.254: Q8.2 R3.2 18.59,48.26 22.4,44.45 22.4,35.1 v21.59,34.29
MOTORENABLE1  (via drill 0.55 pad 0.6)
  Top 0.254: U1.13 23.07,35.56 v21.59,35.56
  Bottom 0.254: Q5.2 R7.2 20.81,33.83 20.81,34.61 21.59,35.4 v21.59,35.56
MOTORENABLE2  (via drill 0.55 pad 0.6)
  Top 0.254: U1.16 27.3,32.11 v26.95,31.75
  Bottom 0.254: Q7.2 R1.2 16.51,52.07 22.86,45.72 22.86,33.02 24.13,31.75 v26.95,31.75
N$1
  Top 2.159: CN1.PWR 32.12,5.08 PSWITCH.2
N$2
  Bottom 0.254: R11.2 44.56,46.55 44.56,45.24 45.24,44.56 46.55,44.56 51.93,39.19 52.52,39.19 53.62,38.1 RPI.12
N$3
  Bottom 0.254: LCD.11 42.86,30.8 R14.2
N$4
  Bottom 0.254: R10.1 51.75,43.5 RPI.7
N$7
  Bottom 0.254: LCD.12 43.99,32.21 43.99,34.33 42.86,35.46 R15.2
N$9
  Bottom 0.254: LCD.13 44.46,34.28 44.46,35.83 42.86,37.43 R16.2
N$10  (via drill 0.55 pad 0.6)
  Top 0.254: v17.78,29.21 R8.2
  Bottom 0.254: GND.1 11.7,29.21 Q5.3 15.46,30.53 15.46,30.26 16.51,29.21 v17.78,29.21
N$11  (via drill 0.55 pad 0.6)
  Top 0.254: v2.54,49.42 3.81,50.69 R2.2
  Bottom 0.254: GND.9 Q7.3 3.43,48.53 v2.54,49.42
N$13
  Top 0.254: R9.2 40.96,26.35 D10.K
N$14
  Bottom 0.254: LCD.14 43.99,37.29 43.99,39.41 42.86,40.54 R17.2
N$15
  Bottom 0.254: LCD.15 44.46,39.36 44.46,41.48 42.86,43.08 R18.2
N$16
  Top 0.254: U1.35 45.18,47.17 45.24,47.1 57.27,47.1 PROG.5
N$17
  Bottom 0.254: LCD.16 45.72,41.07 44.56,42.24 44.56,43.4 42.86,45.1 R19.2
N$18
  Top 0.254: R20.2 43.25,43.18 LCD.17
N$21
  Top 0.254: U1.34 43.91,45.9 45.24,44.56 55,44.56 56.16,45.72 PROG.4
N$26
  Top 0.254: U1.24 37.47,31.09 36.74,30.36 36.74,28.03 D10.A
RPI1  (via drill 0.6)
  Top 0.254: U1.33 39.76,45.12 39.11,45.12 38.1,46.13 v38.1,46.99
  Bottom 0.254: v38.1,46.99 39.37,48.26 R11.1
RPI2  (via drill 0.55 pad 0.6)
  Top 0.254: U1.36 44.27,48.44 45.24,49.41 48.38,49.41 v49.53,48.26
  Bottom 0.254: R10.2 v49.53,48.26
X_MINUS  (via drill 0.55 pad 0.6)
  Top 0.254: U1.8 25.22,42.09 v25.4,41.91
  Bottom 0.254: v25.4,41.91 25.4,36.83 31.24,30.99 38.25,30.99 38.88,30.36 38.88,24.09 45.19,17.78 LCD.7
X_PLUS  (via drill 0.55 pad 0.6)
  Top 0.254: U1.10 27.76,39.55 v27.94,39.37
  Bottom 0.254: v27.94,39.37 27.94,36.83 32.56,32.21 38.33,32.21 44.45,26.09 44.45,24.13 LCD.9
Y_MINUS  (via drill 0.55 pad 0.6)
  Top 0.254: U1.9 26.49,40.82 v26.67,40.64
  Bottom 0.254: LCD.8 43.18,22.86 42.65,22.86 41.91,23.6 41.91,27.98 38.14,31.75 31.75,31.75 26.67,36.83 v26.67,40.64
Y_PLUS  (via drill 0.55 pad 0.6)
  Top 0.254: U1.11 29.03,38.28 v29.21,38.1
  Bottom 0.254: v29.21,38.1 29.21,36.21 32.75,32.66 38.52,32.66 44.91,26.28 44.91,26.21 LCD.10

### Text on the board
tNames: Mind Pitch Pitching / v2.0.0 / 477grp24 / 10-15-2019 | 5V | GND | GND